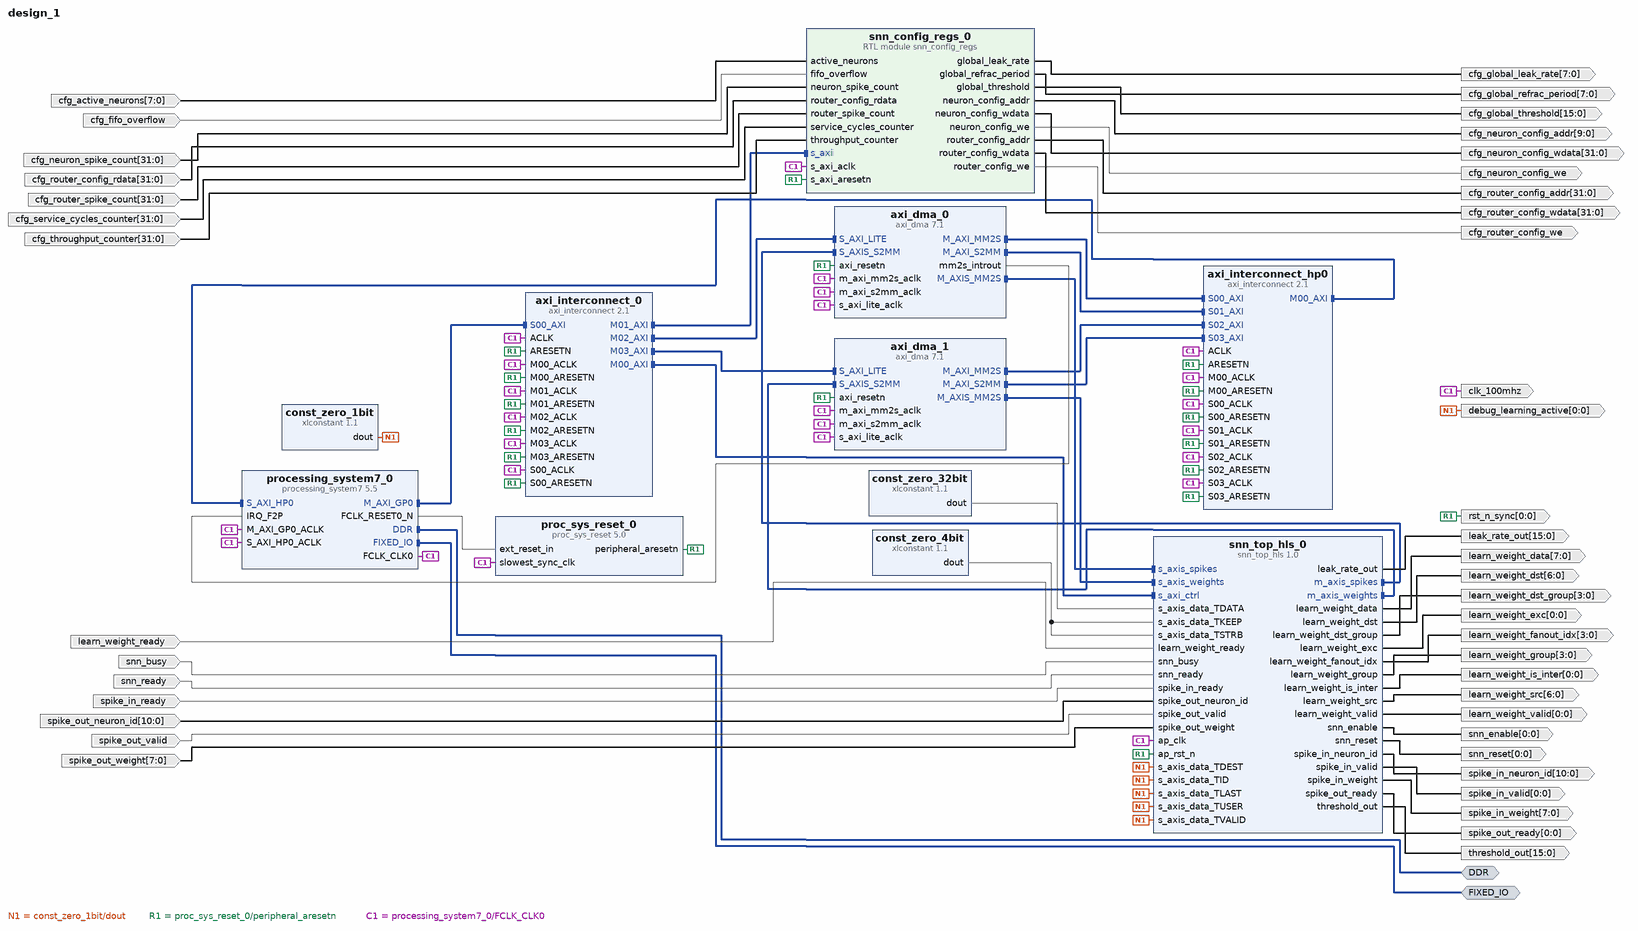
[diagram p0: block diagram of the top level]
# Vivado block design design_1, xc7z020clg400-1, Vivado 2025.2
create_bd_design design_1

create_bd_intf_port -mode Master -vlnv xilinx.com:interface:ddrx_rtl:1.0 DDR
create_bd_intf_port -mode Master -vlnv xilinx.com:display_processing_system7:fixedio_rtl:1.0 FIXED_IO
create_bd_port -dir O -from 0 -to 0 -type data spike_in_valid
create_bd_port -dir O -from 10 -to 0 -type data spike_in_neuron_id
create_bd_port -dir O -from 7 -to 0 -type data spike_in_weight
create_bd_port -dir I -type data spike_in_ready
create_bd_port -dir I -type data spike_out_valid
create_bd_port -dir I -from 10 -to 0 -type data spike_out_neuron_id
create_bd_port -dir I -from 7 -to 0 -type data spike_out_weight
create_bd_port -dir O -from 0 -to 0 -type data spike_out_ready
create_bd_port -dir O -from 0 -to 0 -type data learn_weight_valid
create_bd_port -dir O -from 3 -to 0 -type data learn_weight_group
create_bd_port -dir O -from 6 -to 0 -type data learn_weight_src
create_bd_port -dir O -from 6 -to 0 -type data learn_weight_dst
create_bd_port -dir O -from 7 -to 0 -type data learn_weight_data
create_bd_port -dir O -from 0 -to 0 -type data learn_weight_exc
create_bd_port -dir O -from 0 -to 0 -type data learn_weight_is_inter
create_bd_port -dir O -from 3 -to 0 -type data learn_weight_dst_group
create_bd_port -dir O -from 3 -to 0 -type data learn_weight_fanout_idx
create_bd_port -dir I -type data learn_weight_ready
create_bd_port -dir O -from 0 -to 0 -type data snn_enable
create_bd_port -dir O -from 0 -to 0 -type data snn_reset
create_bd_port -dir I -type data snn_ready
create_bd_port -dir I -type data snn_busy
create_bd_port -dir O -from 15 -to 0 -type data threshold_out
create_bd_port -dir O -from 15 -to 0 -type data leak_rate_out
create_bd_port -dir O -type data cfg_router_config_we
create_bd_port -dir O -from 31 -to 0 -type data cfg_router_config_addr
create_bd_port -dir O -from 31 -to 0 -type data cfg_router_config_wdata
create_bd_port -dir I -from 31 -to 0 -type data cfg_router_config_rdata
create_bd_port -dir O -type data cfg_neuron_config_we
create_bd_port -dir O -from 9 -to 0 -type data cfg_neuron_config_addr
create_bd_port -dir O -from 31 -to 0 -type data cfg_neuron_config_wdata
create_bd_port -dir O -from 15 -to 0 -type data cfg_global_threshold
create_bd_port -dir O -from 7 -to 0 -type data cfg_global_leak_rate
create_bd_port -dir O -from 7 -to 0 -type data cfg_global_refrac_period
create_bd_port -dir I -from 31 -to 0 -type data cfg_router_spike_count
create_bd_port -dir I -from 31 -to 0 -type data cfg_neuron_spike_count
create_bd_port -dir I -type data cfg_fifo_overflow
create_bd_port -dir I -from 7 -to 0 -type data cfg_active_neurons
create_bd_port -dir I -from 31 -to 0 -type data cfg_throughput_counter
create_bd_port -dir I -from 31 -to 0 -type data cfg_service_cycles_counter
create_bd_port -dir O -type clk clk_100mhz
create_bd_port -dir O -from 0 -to 0 -type rst rst_n_sync
create_bd_port -dir O -from 0 -to 0 -type data debug_learning_active

create_bd_cell -type ip -vlnv xilinx.com:ip:processing_system7:5.5 processing_system7_0
set_property -dict [list \
  CONFIG.PCW_ENET0_ENET0_IO EMIO \
  CONFIG.PCW_ENET0_GRP_MDIO_ENABLE 0 \
  CONFIG.PCW_ENET0_PERIPHERAL_ENABLE 1 \
  CONFIG.PCW_ENET0_RESET_ENABLE 0 \
  CONFIG.PCW_ENET_RESET_ENABLE 1 \
  CONFIG.PCW_ENET_RESET_SELECT {Share reset pin} \
  CONFIG.PCW_FPGA0_PERIPHERAL_FREQMHZ 100 \
  CONFIG.PCW_GPIO_MIO_GPIO_ENABLE 1 \
  CONFIG.PCW_GPIO_MIO_GPIO_IO MIO \
  CONFIG.PCW_I2C_RESET_ENABLE 1 \
  CONFIG.PCW_IRQ_F2P_INTR 1 \
  CONFIG.PCW_QSPI_GRP_SINGLE_SS_ENABLE 1 \
  CONFIG.PCW_QSPI_GRP_SINGLE_SS_IO {MIO 1 .. 6} \
  CONFIG.PCW_QSPI_PERIPHERAL_ENABLE 1 \
  CONFIG.PCW_QSPI_QSPI_IO {MIO 1 .. 6} \
  CONFIG.PCW_SD0_GRP_CD_ENABLE 0 \
  CONFIG.PCW_SD0_GRP_WP_ENABLE 0 \
  CONFIG.PCW_SD0_PERIPHERAL_ENABLE 1 \
  CONFIG.PCW_SD0_SD0_IO {MIO 40 .. 45} \
  CONFIG.PCW_SDIO_PERIPHERAL_FREQMHZ 100 \
  CONFIG.PCW_SINGLE_QSPI_DATA_MODE x4 \
  CONFIG.PCW_UART0_PERIPHERAL_ENABLE 1 \
  CONFIG.PCW_UART0_UART0_IO EMIO \
  CONFIG.PCW_UART_PERIPHERAL_FREQMHZ 100 \
  CONFIG.PCW_USB0_PERIPHERAL_ENABLE 1 \
  CONFIG.PCW_USB0_RESET_ENABLE 0 \
  CONFIG.PCW_USB0_USB0_IO {MIO 28 .. 39} \
  CONFIG.PCW_USB_RESET_ENABLE 1 \
  CONFIG.PCW_USB_RESET_SELECT {Share reset pin} \
  CONFIG.PCW_USE_FABRIC_INTERRUPT 1 \
  CONFIG.PCW_USE_S_AXI_HP0 1 \
] [get_bd_cells processing_system7_0]
# 206 more settings of processing_system7_0 are not shown: defaults, MIO pin electricals, DDR timing, and values the tool derives
create_bd_cell -type ip -vlnv xilinx.com:ip:proc_sys_reset:5.0 proc_sys_reset_0
create_bd_cell -type ip -vlnv xilinx.com:ip:axi_dma:7.1 axi_dma_0
set_property -dict [list \
  CONFIG.c_include_sg 0 \
  CONFIG.c_m_axi_mm2s_data_width 32 \
  CONFIG.c_m_axi_s2mm_data_width 32 \
  CONFIG.c_m_axis_mm2s_tdata_width 32 \
  CONFIG.c_mm2s_burst_size 16 \
  CONFIG.c_s2mm_burst_size 16 \
  CONFIG.c_s_axis_s2mm_tdata_width 32 \
  CONFIG.c_sg_length_width 23 \
] [get_bd_cells axi_dma_0]
create_bd_cell -type ip -vlnv xilinx.com:ip:axi_dma:7.1 axi_dma_1
set_property -dict [list \
  CONFIG.c_include_sg 0 \
  CONFIG.c_m_axi_mm2s_data_width 32 \
  CONFIG.c_m_axi_s2mm_data_width 32 \
  CONFIG.c_m_axis_mm2s_tdata_width 32 \
  CONFIG.c_mm2s_burst_size 16 \
  CONFIG.c_s2mm_burst_size 16 \
  CONFIG.c_s_axis_s2mm_tdata_width 32 \
  CONFIG.c_sg_length_width 23 \
] [get_bd_cells axi_dma_1]
create_bd_cell -type ip -vlnv xilinx.com:hls:snn_top_hls:1.0 snn_top_hls_0
create_bd_cell -type module -reference snn_config_regs snn_config_regs_0
create_bd_cell -type ip -vlnv xilinx.com:ip:axi_interconnect:2.1 axi_interconnect_0
set_property -dict {CONFIG.NUM_MI 4} [get_bd_cells axi_interconnect_0]
create_bd_cell -type ip -vlnv xilinx.com:ip:axi_interconnect:2.1 axi_interconnect_hp0
set_property -dict {CONFIG.NUM_MI 1 CONFIG.NUM_SI 4} [get_bd_cells axi_interconnect_hp0]
create_bd_cell -type ip -vlnv xilinx.com:ip:xlconstant:1.1 const_zero_1bit
set_property -dict {CONFIG.CONST_VAL 0} [get_bd_cells const_zero_1bit]
create_bd_cell -type ip -vlnv xilinx.com:ip:xlconstant:1.1 const_zero_32bit
set_property -dict {CONFIG.CONST_VAL 0 CONFIG.CONST_WIDTH 32} [get_bd_cells const_zero_32bit]
create_bd_cell -type ip -vlnv xilinx.com:ip:xlconstant:1.1 const_zero_4bit
set_property -dict {CONFIG.CONST_VAL 0 CONFIG.CONST_WIDTH 4} [get_bd_cells const_zero_4bit]

# ---- connections ----

connect_bd_intf_net [get_bd_intf_pins axi_dma_0/M_AXIS_MM2S] [get_bd_intf_pins snn_top_hls_0/s_axis_spikes]
connect_bd_intf_net [get_bd_intf_pins axi_dma_0/M_AXI_MM2S] [get_bd_intf_pins axi_interconnect_hp0/S00_AXI]
connect_bd_intf_net [get_bd_intf_pins axi_dma_0/M_AXI_S2MM] [get_bd_intf_pins axi_interconnect_hp0/S01_AXI]
connect_bd_intf_net [get_bd_intf_pins axi_dma_1/M_AXIS_MM2S] [get_bd_intf_pins snn_top_hls_0/s_axis_weights]
connect_bd_intf_net [get_bd_intf_pins axi_dma_1/M_AXI_MM2S] [get_bd_intf_pins axi_interconnect_hp0/S02_AXI]
connect_bd_intf_net [get_bd_intf_pins axi_dma_1/M_AXI_S2MM] [get_bd_intf_pins axi_interconnect_hp0/S03_AXI]
connect_bd_intf_net [get_bd_intf_pins axi_interconnect_0/M00_AXI] [get_bd_intf_pins snn_top_hls_0/s_axi_ctrl]
connect_bd_intf_net [get_bd_intf_pins axi_interconnect_0/M01_AXI] [get_bd_intf_pins snn_config_regs_0/s_axi]
connect_bd_intf_net [get_bd_intf_pins axi_interconnect_0/M02_AXI] [get_bd_intf_pins axi_dma_0/S_AXI_LITE]
connect_bd_intf_net [get_bd_intf_pins axi_interconnect_0/M03_AXI] [get_bd_intf_pins axi_dma_1/S_AXI_LITE]
connect_bd_intf_net [get_bd_intf_pins axi_interconnect_hp0/M00_AXI] [get_bd_intf_pins processing_system7_0/S_AXI_HP0]
connect_bd_intf_net [get_bd_intf_pins processing_system7_0/DDR] [get_bd_intf_ports DDR]
connect_bd_intf_net [get_bd_intf_pins processing_system7_0/FIXED_IO] [get_bd_intf_ports FIXED_IO]
connect_bd_intf_net [get_bd_intf_pins processing_system7_0/M_AXI_GP0] [get_bd_intf_pins axi_interconnect_0/S00_AXI]
connect_bd_intf_net [get_bd_intf_pins snn_top_hls_0/m_axis_spikes] [get_bd_intf_pins axi_dma_0/S_AXIS_S2MM]
connect_bd_intf_net [get_bd_intf_pins snn_top_hls_0/m_axis_weights] [get_bd_intf_pins axi_dma_1/S_AXIS_S2MM]
connect_bd_net [get_bd_pins axi_dma_0/mm2s_introut] [get_bd_pins processing_system7_0/IRQ_F2P]
connect_bd_net [get_bd_ports cfg_active_neurons] [get_bd_pins snn_config_regs_0/active_neurons]
connect_bd_net [get_bd_ports cfg_fifo_overflow] [get_bd_pins snn_config_regs_0/fifo_overflow]
connect_bd_net [get_bd_ports cfg_neuron_spike_count] [get_bd_pins snn_config_regs_0/neuron_spike_count]
connect_bd_net [get_bd_ports cfg_router_config_rdata] [get_bd_pins snn_config_regs_0/router_config_rdata]
connect_bd_net [get_bd_ports cfg_router_spike_count] [get_bd_pins snn_config_regs_0/router_spike_count]
connect_bd_net [get_bd_ports cfg_service_cycles_counter] [get_bd_pins snn_config_regs_0/service_cycles_counter]
connect_bd_net [get_bd_ports cfg_throughput_counter] [get_bd_pins snn_config_regs_0/throughput_counter]
connect_bd_net [get_bd_pins const_zero_1bit/dout] \
  [get_bd_pins snn_top_hls_0/s_axis_data_TVALID] [get_bd_pins snn_top_hls_0/s_axis_data_TLAST] \
  [get_bd_pins snn_top_hls_0/s_axis_data_TID] [get_bd_pins snn_top_hls_0/s_axis_data_TDEST] \
  [get_bd_pins snn_top_hls_0/s_axis_data_TUSER] [get_bd_ports debug_learning_active]
connect_bd_net [get_bd_pins const_zero_32bit/dout] [get_bd_pins snn_top_hls_0/s_axis_data_TDATA]
connect_bd_net [get_bd_pins const_zero_4bit/dout] [get_bd_pins snn_top_hls_0/s_axis_data_TKEEP] [get_bd_pins snn_top_hls_0/s_axis_data_TSTRB]
connect_bd_net [get_bd_ports learn_weight_ready] [get_bd_pins snn_top_hls_0/learn_weight_ready]
connect_bd_net [get_bd_pins proc_sys_reset_0/peripheral_aresetn] \
  [get_bd_pins snn_top_hls_0/ap_rst_n] [get_bd_pins snn_config_regs_0/s_axi_aresetn] [get_bd_pins axi_dma_0/axi_resetn] \
  [get_bd_pins axi_dma_1/axi_resetn] [get_bd_pins axi_interconnect_0/ARESETN] [get_bd_pins axi_interconnect_0/S00_ARESETN] \
  [get_bd_pins axi_interconnect_0/M00_ARESETN] [get_bd_pins axi_interconnect_0/M01_ARESETN] \
  [get_bd_pins axi_interconnect_0/M02_ARESETN] [get_bd_pins axi_interconnect_0/M03_ARESETN] \
  [get_bd_pins axi_interconnect_hp0/ARESETN] [get_bd_pins axi_interconnect_hp0/S00_ARESETN] \
  [get_bd_pins axi_interconnect_hp0/S01_ARESETN] [get_bd_pins axi_interconnect_hp0/S02_ARESETN] \
  [get_bd_pins axi_interconnect_hp0/S03_ARESETN] [get_bd_pins axi_interconnect_hp0/M00_ARESETN] [get_bd_ports rst_n_sync]
connect_bd_net [get_bd_pins processing_system7_0/FCLK_CLK0] \
  [get_bd_pins proc_sys_reset_0/slowest_sync_clk] [get_bd_pins axi_dma_0/s_axi_lite_aclk] \
  [get_bd_pins axi_dma_0/m_axi_mm2s_aclk] [get_bd_pins axi_dma_0/m_axi_s2mm_aclk] [get_bd_pins axi_dma_1/s_axi_lite_aclk] \
  [get_bd_pins axi_dma_1/m_axi_mm2s_aclk] [get_bd_pins axi_dma_1/m_axi_s2mm_aclk] [get_bd_pins snn_top_hls_0/ap_clk] \
  [get_bd_pins snn_config_regs_0/s_axi_aclk] [get_bd_pins axi_interconnect_0/ACLK] [get_bd_pins axi_interconnect_0/S00_ACLK] \
  [get_bd_pins axi_interconnect_0/M00_ACLK] [get_bd_pins axi_interconnect_0/M01_ACLK] \
  [get_bd_pins axi_interconnect_0/M02_ACLK] [get_bd_pins axi_interconnect_0/M03_ACLK] [get_bd_pins axi_interconnect_hp0/ACLK] \
  [get_bd_pins axi_interconnect_hp0/S00_ACLK] [get_bd_pins axi_interconnect_hp0/S01_ACLK] \
  [get_bd_pins axi_interconnect_hp0/S02_ACLK] [get_bd_pins axi_interconnect_hp0/S03_ACLK] \
  [get_bd_pins axi_interconnect_hp0/M00_ACLK] [get_bd_pins processing_system7_0/M_AXI_GP0_ACLK] \
  [get_bd_pins processing_system7_0/S_AXI_HP0_ACLK] [get_bd_ports clk_100mhz]
connect_bd_net [get_bd_pins processing_system7_0/FCLK_RESET0_N] [get_bd_pins proc_sys_reset_0/ext_reset_in]
connect_bd_net [get_bd_ports snn_busy] [get_bd_pins snn_top_hls_0/snn_busy]
connect_bd_net [get_bd_pins snn_config_regs_0/global_leak_rate] [get_bd_ports cfg_global_leak_rate]
connect_bd_net [get_bd_pins snn_config_regs_0/global_refrac_period] [get_bd_ports cfg_global_refrac_period]
connect_bd_net [get_bd_pins snn_config_regs_0/global_threshold] [get_bd_ports cfg_global_threshold]
connect_bd_net [get_bd_pins snn_config_regs_0/neuron_config_addr] [get_bd_ports cfg_neuron_config_addr]
connect_bd_net [get_bd_pins snn_config_regs_0/neuron_config_wdata] [get_bd_ports cfg_neuron_config_wdata]
connect_bd_net [get_bd_pins snn_config_regs_0/neuron_config_we] [get_bd_ports cfg_neuron_config_we]
connect_bd_net [get_bd_pins snn_config_regs_0/router_config_addr] [get_bd_ports cfg_router_config_addr]
connect_bd_net [get_bd_pins snn_config_regs_0/router_config_wdata] [get_bd_ports cfg_router_config_wdata]
connect_bd_net [get_bd_pins snn_config_regs_0/router_config_we] [get_bd_ports cfg_router_config_we]
connect_bd_net [get_bd_ports snn_ready] [get_bd_pins snn_top_hls_0/snn_ready]
connect_bd_net [get_bd_pins snn_top_hls_0/leak_rate_out] [get_bd_ports leak_rate_out]
connect_bd_net [get_bd_pins snn_top_hls_0/learn_weight_data] [get_bd_ports learn_weight_data]
connect_bd_net [get_bd_pins snn_top_hls_0/learn_weight_dst] [get_bd_ports learn_weight_dst]
connect_bd_net [get_bd_pins snn_top_hls_0/learn_weight_dst_group] [get_bd_ports learn_weight_dst_group]
connect_bd_net [get_bd_pins snn_top_hls_0/learn_weight_exc] [get_bd_ports learn_weight_exc]
connect_bd_net [get_bd_pins snn_top_hls_0/learn_weight_fanout_idx] [get_bd_ports learn_weight_fanout_idx]
connect_bd_net [get_bd_pins snn_top_hls_0/learn_weight_group] [get_bd_ports learn_weight_group]
connect_bd_net [get_bd_pins snn_top_hls_0/learn_weight_is_inter] [get_bd_ports learn_weight_is_inter]
connect_bd_net [get_bd_pins snn_top_hls_0/learn_weight_src] [get_bd_ports learn_weight_src]
connect_bd_net [get_bd_pins snn_top_hls_0/learn_weight_valid] [get_bd_ports learn_weight_valid]
connect_bd_net [get_bd_pins snn_top_hls_0/snn_enable] [get_bd_ports snn_enable]
connect_bd_net [get_bd_pins snn_top_hls_0/snn_reset] [get_bd_ports snn_reset]
connect_bd_net [get_bd_pins snn_top_hls_0/spike_in_neuron_id] [get_bd_ports spike_in_neuron_id]
connect_bd_net [get_bd_pins snn_top_hls_0/spike_in_valid] [get_bd_ports spike_in_valid]
connect_bd_net [get_bd_pins snn_top_hls_0/spike_in_weight] [get_bd_ports spike_in_weight]
connect_bd_net [get_bd_pins snn_top_hls_0/spike_out_ready] [get_bd_ports spike_out_ready]
connect_bd_net [get_bd_pins snn_top_hls_0/threshold_out] [get_bd_ports threshold_out]
connect_bd_net [get_bd_ports spike_in_ready] [get_bd_pins snn_top_hls_0/spike_in_ready]
connect_bd_net [get_bd_ports spike_out_neuron_id] [get_bd_pins snn_top_hls_0/spike_out_neuron_id]
connect_bd_net [get_bd_ports spike_out_valid] [get_bd_pins snn_top_hls_0/spike_out_valid]
connect_bd_net [get_bd_ports spike_out_weight] [get_bd_pins snn_top_hls_0/spike_out_weight]

# ---- address map ----
assign_bd_address -offset 0x00000000 -range 512M -target_address_space [get_bd_addr_spaces axi_dma_0/Data_MM2S] [get_bd_addr_segs processing_system7_0/S_AXI_HP0/HP0_DDR_LOWOCM]
assign_bd_address -offset 0x00000000 -range 512M -target_address_space [get_bd_addr_spaces axi_dma_0/Data_S2MM] [get_bd_addr_segs processing_system7_0/S_AXI_HP0/HP0_DDR_LOWOCM]
assign_bd_address -offset 0x00000000 -range 512M -target_address_space [get_bd_addr_spaces axi_dma_1/Data_MM2S] [get_bd_addr_segs processing_system7_0/S_AXI_HP0/HP0_DDR_LOWOCM]
assign_bd_address -offset 0x00000000 -range 512M -target_address_space [get_bd_addr_spaces axi_dma_1/Data_S2MM] [get_bd_addr_segs processing_system7_0/S_AXI_HP0/HP0_DDR_LOWOCM]
assign_bd_address -offset 0x41E00000 -range 64K -target_address_space [get_bd_addr_spaces processing_system7_0/Data] [get_bd_addr_segs axi_dma_0/S_AXI_LITE/Reg]
assign_bd_address -offset 0x41E10000 -range 64K -target_address_space [get_bd_addr_spaces processing_system7_0/Data] [get_bd_addr_segs axi_dma_1/S_AXI_LITE/Reg]
assign_bd_address -offset 0x43C00000 -range 4K -target_address_space [get_bd_addr_spaces processing_system7_0/Data] [get_bd_addr_segs snn_top_hls_0/s_axi_ctrl/Reg]
assign_bd_address -offset 0x43C10000 -range 4K -target_address_space [get_bd_addr_spaces processing_system7_0/Data] [get_bd_addr_segs snn_config_regs_0/s_axi/reg0]

validate_bd_design
save_bd_design
